# Altium schematic sheet 384X_PWMMOD.SchDoc
size A4
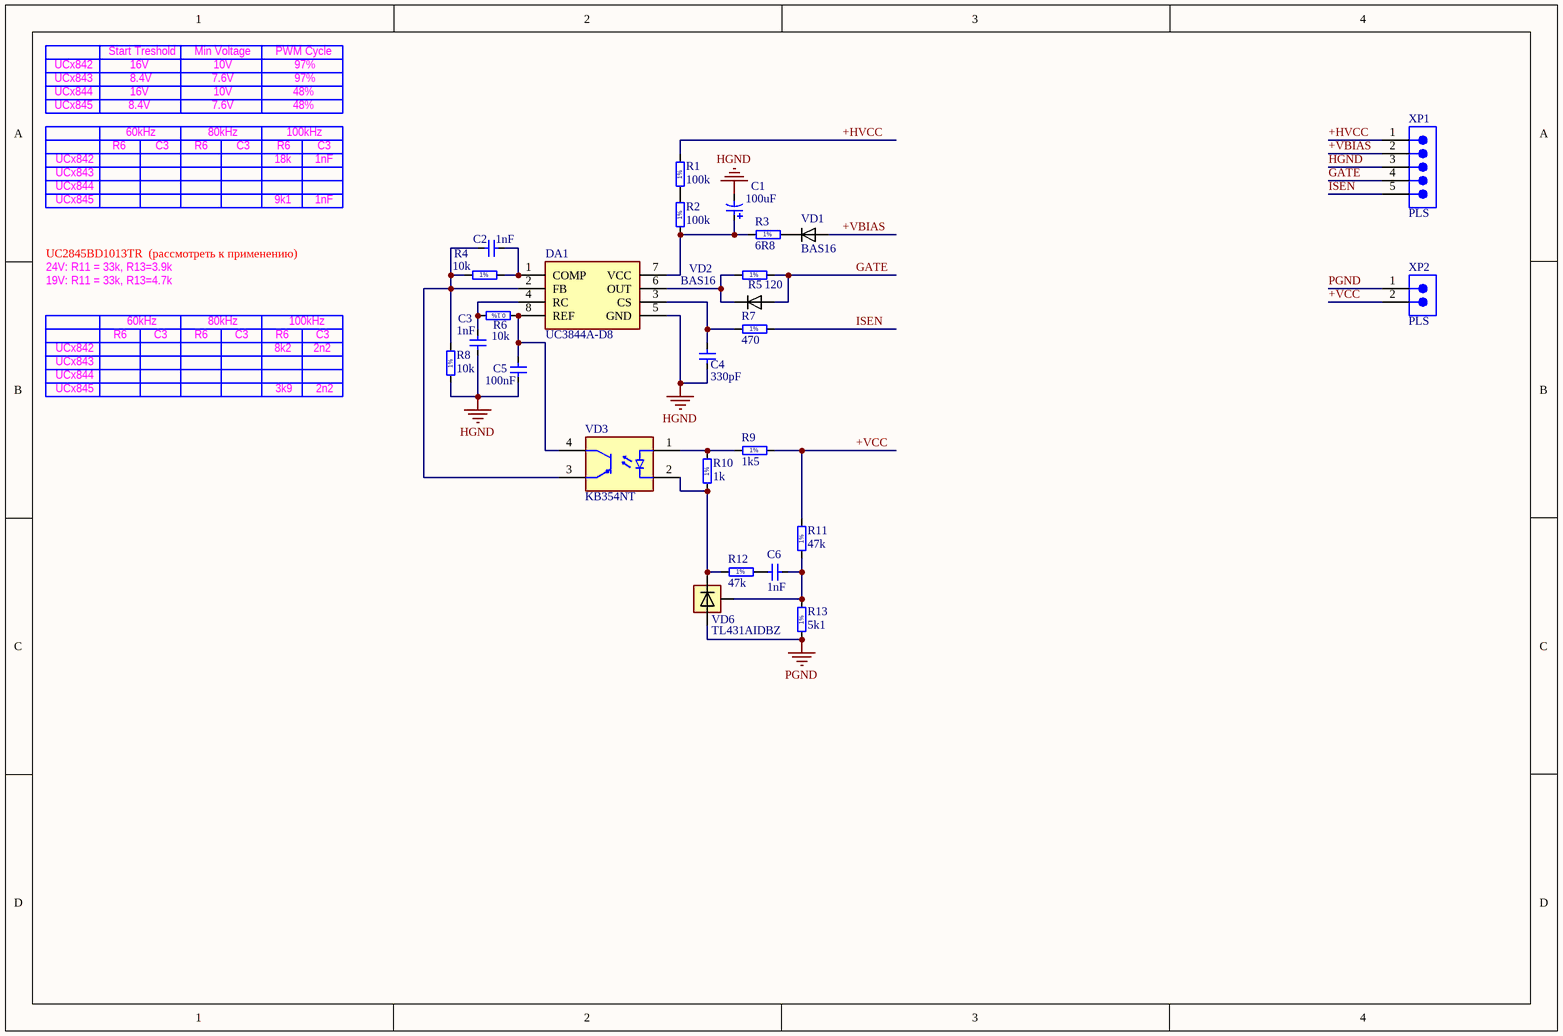
[diagram p0: 384X_PWMMOD.SchDoc]

## Parts
C1  100uF  [CAP_EL_06_11_VERT]
C2  1nF  [CAP0805R]
C3  1nF  [CAP0805R]
C4  330pF  [CAP0805R]
C5  100nF  [CAP0805R]
C6  1nF  [CAP0805R]
DA1  UC3844A-D8  [SOP8]
R1  100k  [RES1206R]
R2  100k  [RES1206R]
R3  6R8  [RES0805R]
R4  10k  [RES0805R]
R5  120  [RES0805R]
R6  10k  [RES0805R]
R7  470  [RES0805R]
R8  10k  [RES0805R]
R9  1k5  [RES0805R]
R10  1k  [RES0805R]
R11  47k  [RES0805R]
R12  47k  [RES0805R]
R13  5k1  [RES0805R]
VD1  BAS16  [SOT23]
VD2  BAS16  [SOT23]
VD3  KB354NT  [SOP4]
VD6  TL431AIDBZ  [SOT23]
XP1  PLS  [PLS-05]
XP2  PLS  [PLS-02]

## Nets
HGND: C1.2 C3.1 C4.1 C5.1 DA1.5(GND) R8.1 XP1.3
PGND: R13.1 VD6.3(A) XP2.1
+HVCC: R1.2 XP1.1
+VBIAS: VD1.1(A) XP1.2
+VCC: R9.2 R11.2 XP2.2
GATE: R5.2 VD2.1(A) XP1.4
ISEN: R7.2 XP1.5
NetC1_1: C1.1 DA1.7(VCC) R2.1 R3.1
NetC2_1: C2.1 DA1.2(FB) R4.1 R8.2 VD3.3(E)
NetC2_2: C2.2 DA1.1(COMP) R4.2
NetC3_2: C3.2 DA1.4(RC) R6.2
NetC4_2: C4.2 DA1.3(CS) R7.1
NetC5_2: C5.2 DA1.8(REF) R6.1 VD3.4(C)
NetC6_1: C6.1 R12.2
NetC6_2: C6.2 R11.1 R13.2 VD6.2(REF)
NetDA1_6: DA1.6(OUT) R5.1 VD2.3(K)
NetR1_1: R1.1 R2.2
NetR3_2: R3.2 VD1.3(K)
NetR9_1: R9.1 R10.2 VD3.1
NetR10_1: R10.1 R12.1 VD3.2 VD6.1(K)

## Notes on the sheet
- UCx842
- UCx843
- UCx844
- UCx845
- Start Treshold
- 8.4V
- 16V
- Min Voltage
- 7.6V
- 10V
- PWM Cycle
- 48%
- 97%
- R6
- 60kHz
- C3
- 80kHz
- 18k
- 100kHz
- 1nF
- 9k1
- UC2845BD1013TR  (рассмотреть к применению)
- 19V: R11 = 33k, R13=4.7k
- 24V: R11 = 33k, R13=3.9k
- 8k2
- 2n2
- 3k9
- (in symbol R0805_1K5_1%_0.125W_100PPM) 1%
- (in symbol R0805_1K_1%_0.125W_100PPM) 1%
- (in symbol R0805_5K1_1%_0.125W_100PPM) 1%
- (in symbol R0805_6R8_1%_0.125W_200PPM) 1%
- (in symbol R0805_10K_0.1%_0.1W_10PPM) 0.1%
- (in symbol R0805_10K_1%_0.125W_100PPM) 1%
- (in symbol R0805_47K_1%_0.125W_100PPM) 1%
- (in symbol R0805_120R_1%_0.125W_100PPM) 1%
- (in symbol R0805_470R_1%_0.125W_100PPM) 1%
- (in symbol R1206_100K_1%_0.25W_100PPM) 1%

## Library data of the parts
C1 = SH016M0100BZF-0611 (VERT MOUNTED): Voltage: 16V; Table: Electrolytic THD; Part Number: SH016M0100BZF-0611 (VERT MOUNTED); Value: 100uF
C2 C3 C6 = CC0805_1NF_50V_5%_X7R: SMD 0805 Capacitor; Part Description: SMD Multilayer Chip Ceramic Capacitor; Manufacturer: GENERIC; Manufacturer1 Part Number: 08055C102JAT2A; Voltage: 50V; TC: X7R; Tolerance: ±5%; Table: Capacitors SMD; Part Number: CC0805_1NF_50V_5%_X7R; Component Kind: Standard; Component Type: Standard; Pin Count: 2; Value: 1nF; Status: None; Manufacturer Part Number: CC0805_1NF_50V_5%_X7R; Case: 0805; Mounted: Yes; Socket: No; SMD: Yes; Manufacturer1 Example: AVX; Manufacturer1 ComponentHeight: 0.94mm; HelpURL: \\cern.ch\dfs\Applications\Altium\Datasheets\CC0805_X7R_AVX.pdf; Author: I. Kuznetsov; CreateDate: 18.01.2011; LatestRevisionDate: 18.01.2011
C4 = CC0805_330PF_50V_5%_NP0: SMD 0805 Capacitor; Part Description: SMD Multilayer Chip Ceramic Capacitor; Manufacturer: GENERIC; Manufacturer1 Part Number: 223886115331; Voltage: 50V; TC: NP0; Tolerance: ±5%; Table: Capacitors SMD; Part Number: CC0805_330PF_50V_5%_NP0; Component Kind: Standard; Component Type: Standard; Pin Count: 2; Value: 330pF; Status: Preferred; Manufacturer Part Number: CC0805_330PF_50V_5%_NP0; Case: 0805; Mounted: Yes; Socket: No; SMD: Yes; Manufacturer1 Example: PHYCOMP; Manufacturer1 ComponentHeight: 1.35mm; HelpURL: \\cern.ch\dfs\Applications\Altium\Datasheets\CC0805_NP0_PHYCOMP.pdf; Author: I. Kuznetsov; CreateDate: 03.12.2007; LatestRevisionDate: 03.12.2007
C5 = CC0805_100NF_50V_10%_X7R: SMD 0805 Capacitor; Part Description: SMD Multilayer Chip Ceramic Capacitor; Manufacturer: GENERIC; Manufacturer1 Part Number: B37941K5104K62; Voltage: 50V; TC: X7R; Tolerance: ±10%; Table: Capacitors SMD; Part Number: CC0805_100NF_50V_10%_X7R; Component Kind: Standard; Component Type: Standard; Pin Count: 2; Value: 100nF; Status: Preferred; Manufacturer Part Number: CC0805_100NF_50V_10%_X7R; Case: 0805; Mounted: Yes; Socket: No; SMD: Yes; Manufacturer1 Example: EPCOS; Manufacturer1 ComponentHeight: 1.35mm; HelpURL: \\cern.ch\dfs\Applications\Altium\Datasheets\CC0805_X7R_EPCOS.pdf; Author: I. Kuznetsov; CreateDate: 03.12.2007; LatestRevisionDate: 03.12.2007
R1 R2 = R1206_100K_1%_0.25W_100PPM: Part Description: General Purpose Thick Film Chip Resistor; Manufacturer: GENERIC; Manufacturer1 Part Number: NRC12F1003TRF; Power: 0.25W; TC: ±100ppm/°C; Tolerance: ±1%; Table: Resistors SMD; Part Number: R1206_100K_1%_0.25W_100PPM; Component Kind: Standard; Component Type: Standard; Footprint: RESC3216X65N; Pin Count: 2; Value: 100k; Status: Preferred; Manufacturer Part Number: R1206_100K_1%_0.25W_100PPM; Case: 1206; Mounted: Yes; Socket: No; SMD: Yes; Manufacturer1 Example: NIC COMPONENT; Manufacturer1 ComponentHeight: 0.65mm; HelpURL: \\cern.ch\dfs\Applications\Altium\Datasheets\R1206_NIC_NRC.pdf; Author: CERN DEM JLC; CreateDate: 03.12.2007; LatestRevisionDate: 13.03.2008
R3 = R0805_6R8_1%_0.125W_200PPM: Part Description: General Purpose Thick Film Chip Resistor; Manufacturer: GENERIC; Manufacturer1 Part Number: 232273466808L or RC0805FR-076R8L; Power: 0.125W; TC: ±200ppm/°C; Tolerance: ±1%; Table: Resistors SMD; Part Number: R0805_6R8_1%_0.125W_200PPM; Component Kind: Standard; Component Type: Standard; Footprint: RESC2012X60N; Pin Count: 2; Value: 6R8; Status: Preferred; Manufacturer Part Number: R0805_6R8_1%_0.125W_200PPM; Case: 0805; Mounted: Yes; Socket: No; SMD: Yes; Manufacturer1 Example: YAGEO PHYCOMP; Manufacturer1 ComponentHeight: 0.65mm; HelpURL: \\cern.ch\dfs\Applications\Altium\Datasheets\R0805_Phycomp_RC0805.pdf; Author: CERN DEM JLC; CreateDate: 03.12.2007; LatestRevisionDate: 17.10.2012
R4 R8 = R0805_10K_1%_0.125W_100PPM: Part Description: General Purpose Thick Film Chip Resistor; Manufacturer: GENERIC; Manufacturer1 Part Number: NRC10F1002TRF; Power: 0.125W; TC: ±100ppm/°C; Tolerance: ±1%; Table: Resistors SMD; Part Number: R0805_10K_1%_0.125W_100PPM; Component Kind: Standard; Component Type: Standard; Footprint: RESC2012X60N; Pin Count: 2; Value: 10k; Status: Preferred; Manufacturer Part Number: R0805_10K_1%_0.125W_100PPM; Case: 0805; Mounted: Yes; Socket: No; SMD: Yes; Manufacturer1 Example: NIC COMPONENT; Manufacturer1 ComponentHeight: 0.6mm; HelpURL: \\cern.ch\dfs\Applications\Altium\Datasheets\R0805_NIC_NRC.pdf; Author: CERN DEM JLC; CreateDate: 03.12.2007; LatestRevisionDate: 13.03.2008
R5 = R0805_120R_1%_0.125W_100PPM: Part Description: General Purpose Thick Film Chip Resistor; Manufacturer: GENERIC; Manufacturer1 Part Number: NRC10F1200TRF; Power: 0.125W; TC: ±100ppm/°C; Tolerance: ±1%; Table: Resistors SMD; Part Number: R0805_120R_1%_0.125W_100PPM; Component Kind: Standard; Component Type: Standard; Footprint: RESC2012X60N; Pin Count: 2; Value: 120; Status: Preferred; Manufacturer Part Number: R0805_120R_1%_0.125W_100PPM; Case: 0805; Mounted: Yes; Socket: No; SMD: Yes; Manufacturer1 Example: NIC COMPONENT; Manufacturer1 ComponentHeight: 0.6mm; HelpURL: \\cern.ch\dfs\Applications\Altium\Datasheets\R0805_NIC_NRC.pdf; Author: CERN DEM JLC; CreateDate: 03.12.2007; LatestRevisionDate: 13.03.2008
R6 = R0805_10K_0.1%_0.1W_10PPM: Part Description: Thin Film Chip Resistor; Manufacturer: GENERIC; Manufacturer1 Part Number: RN73C2A10KBTG; Power: 0.1W; TC: ±10ppm; Tolerance: ±0.1%; Table: Resistors SMD; Part Number: R0805_10K_0.1%_0.1W_10PPM; Component Kind: Standard; Component Type: Standard; Footprint: RESC2012X60N; Pin Count: 2; Value: 10k; Status: Not recommended; Manufacturer Part Number: R0805_10K_0.1%_0.1W_10PPM; Case: 0805; Mounted: Yes; Socket: No; SMD: Yes; Manufacturer1 Example: TYCO HOLSWORTHY; Manufacturer1 ComponentHeight: 0.6mm; HelpURL: \\cern.ch\dfs\Applications\Altium\Datasheets\R0805_Tyco_RN73.pdf; Author: CERN DEM JLC; CreateDate: 03.12.2007; LatestRevisionDate: 13.03.2008
R7 = R0805_470R_1%_0.125W_100PPM: Part Description: General Purpose Thick Film Chip Resistor; Manufacturer: GENERIC; Manufacturer1 Part Number: NRC10F4700TRF; Power: 0.125W; TC: ±100ppm/°C; Tolerance: ±1%; Table: Resistors SMD; Part Number: R0805_470R_1%_0.125W_100PPM; Component Kind: Standard; Component Type: Standard; Footprint: RESC2012X60N; Pin Count: 2; Value: 470; Status: Preferred; Manufacturer Part Number: R0805_470R_1%_0.125W_100PPM; Case: 0805; Mounted: Yes; Socket: No; SMD: Yes; Manufacturer1 Example: NIC COMPONENT; Manufacturer1 ComponentHeight: 0.6mm; HelpURL: \\cern.ch\dfs\Applications\Altium\Datasheets\R0805_NIC_NRC.pdf; Author: CERN DEM JLC; CreateDate: 03.12.2007; LatestRevisionDate: 13.03.2008
R9 = R0805_1K5_1%_0.125W_100PPM: Part Description: General Purpose Thick Film Chip Resistor; Manufacturer: GENERIC; Manufacturer1 Part Number: NRC10F1501TRF; Power: 0.125W; TC: ±100ppm/°C; Tolerance: ±1%; Table: Resistors SMD; Part Number: R0805_1K5_1%_0.125W_100PPM; Component Kind: Standard; Component Type: Standard; Footprint: RESC2012X60N; Pin Count: 2; Value: 1k5; Status: Preferred; Manufacturer Part Number: R0805_1K5_1%_0.125W_100PPM; Case: 0805; Mounted: Yes; Socket: No; SMD: Yes; Manufacturer1 Example: NIC COMPONENT; Manufacturer1 ComponentHeight: 0.6mm; HelpURL: \\cern.ch\dfs\Applications\Altium\Datasheets\R0805_NIC_NRC.pdf; Author: CERN DEM JLC; CreateDate: 03.12.2007; LatestRevisionDate: 13.03.2008
R10 = R0805_1K_1%_0.125W_100PPM: Part Description: General Purpose Thick Film Chip Resistor; Manufacturer: GENERIC; Manufacturer1 Part Number: NRC10F1001TRF; Power: 0.125W; TC: ±100ppm/°C; Tolerance: ±1%; Table: Resistors SMD; Part Number: R0805_1K_1%_0.125W_100PPM; Component Kind: Standard; Component Type: Standard; Footprint: RESC2012X60N; Pin Count: 2; Value: 1k; Status: Preferred; Manufacturer Part Number: R0805_1K_1%_0.125W_100PPM; Case: 0805; Mounted: Yes; Socket: No; SMD: Yes; Manufacturer1 Example: NIC COMPONENT; Manufacturer1 ComponentHeight: 0.6mm; HelpURL: \\cern.ch\dfs\Applications\Altium\Datasheets\R0805_NIC_NRC.pdf; Author: CERN DEM JLC; CreateDate: 03.12.2007; LatestRevisionDate: 13.03.2008
R11 R12 = R0805_47K_1%_0.125W_100PPM: Part Description: General Purpose Thick Film Chip Resistor; Manufacturer: GENERIC; Manufacturer1 Part Number: NRC10F4702TRF; Power: 0.125W; TC: ±100ppm/°C; Tolerance: ±1%; Table: Resistors SMD; Part Number: R0805_47K_1%_0.125W_100PPM; Component Kind: Standard; Component Type: Standard; Footprint: RESC2012X60N; Pin Count: 2; Value: 47k; Status: Preferred; Manufacturer Part Number: R0805_47K_1%_0.125W_100PPM; Case: 0805; Mounted: Yes; Socket: No; SMD: Yes; Manufacturer1 Example: NIC COMPONENT; Manufacturer1 ComponentHeight: 0.6mm; HelpURL: \\cern.ch\dfs\Applications\Altium\Datasheets\R0805_NIC_NRC.pdf; Author: CERN DEM JLC; CreateDate: 03.12.2007; LatestRevisionDate: 13.03.2008
R13 = R0805_5K1_1%_0.125W_100PPM: Part Description: General Purpose Thick Film Chip Resistor; Manufacturer: GENERIC; Manufacturer1 Part Number: NRC10F5101TRF; Power: 0.125W; TC: ±100ppm/°C; Tolerance: ±1%; Table: Resistors SMD; Part Number: R0805_5K1_1%_0.125W_100PPM; Component Kind: Standard; Component Type: Standard; Footprint: RESC2012X60N; Pin Count: 2; Value: 5k1; Status: Preferred; Manufacturer Part Number: R0805_5K1_1%_0.125W_100PPM; Case: 0805; Mounted: Yes; Socket: No; SMD: Yes; Manufacturer1 Example: NIC COMPONENT; Manufacturer1 ComponentHeight: 0.6mm; HelpURL: \\cern.ch\dfs\Applications\Altium\Datasheets\R0805_NIC_NRC.pdf; Author: CERN DEM JLC; CreateDate: 03.12.2007; LatestRevisionDate: 13.03.2008
VD1 = BAS16: Shottky Diode; PartNumber: BAS16
VD2 = BAS16: Table: Diode; Part Number: BAS16; Device: BAS16
VD3 = KB354NT: Table: Optocouplers; Part Number: KB354NT; Device: KB354NT
VD6 = TL431AIDBZ: Table: Diode; Part Number: TL431AIDBZ; Device: TL431AIDBZ
XP1 = PLS-05: Manufacturer: AUK; Part Number: PLS-05; Component Kind: Standard; Component Type: Standard; PackageDescription: PLS-05; Pin Count: 5; Family: PLS; SMD: Yes; Device: PLS-05; Manufacturer Part Number: PLS-05; ComponentLink1URL: http://lib.chipdip.ru/227/DOC000227157.pdf; Table: AUK
XP2 = PLS-02: Manufacturer: AUK; Part Number: PLS-02; Component Kind: Standard; Component Type: Standard; PackageDescription: PLS-02; Pin Count: 2; Family: PLS; SMD: No; Device: PLS-02; Manufacturer Part Number: PLS-02; ComponentLink1URL: http://lib.chipdip.ru/227/DOC000227157.pdf; Table: AUK
DA1 = UC3844A-D8: Part Number: UC3844A-D8; Device: UC3844A-D8